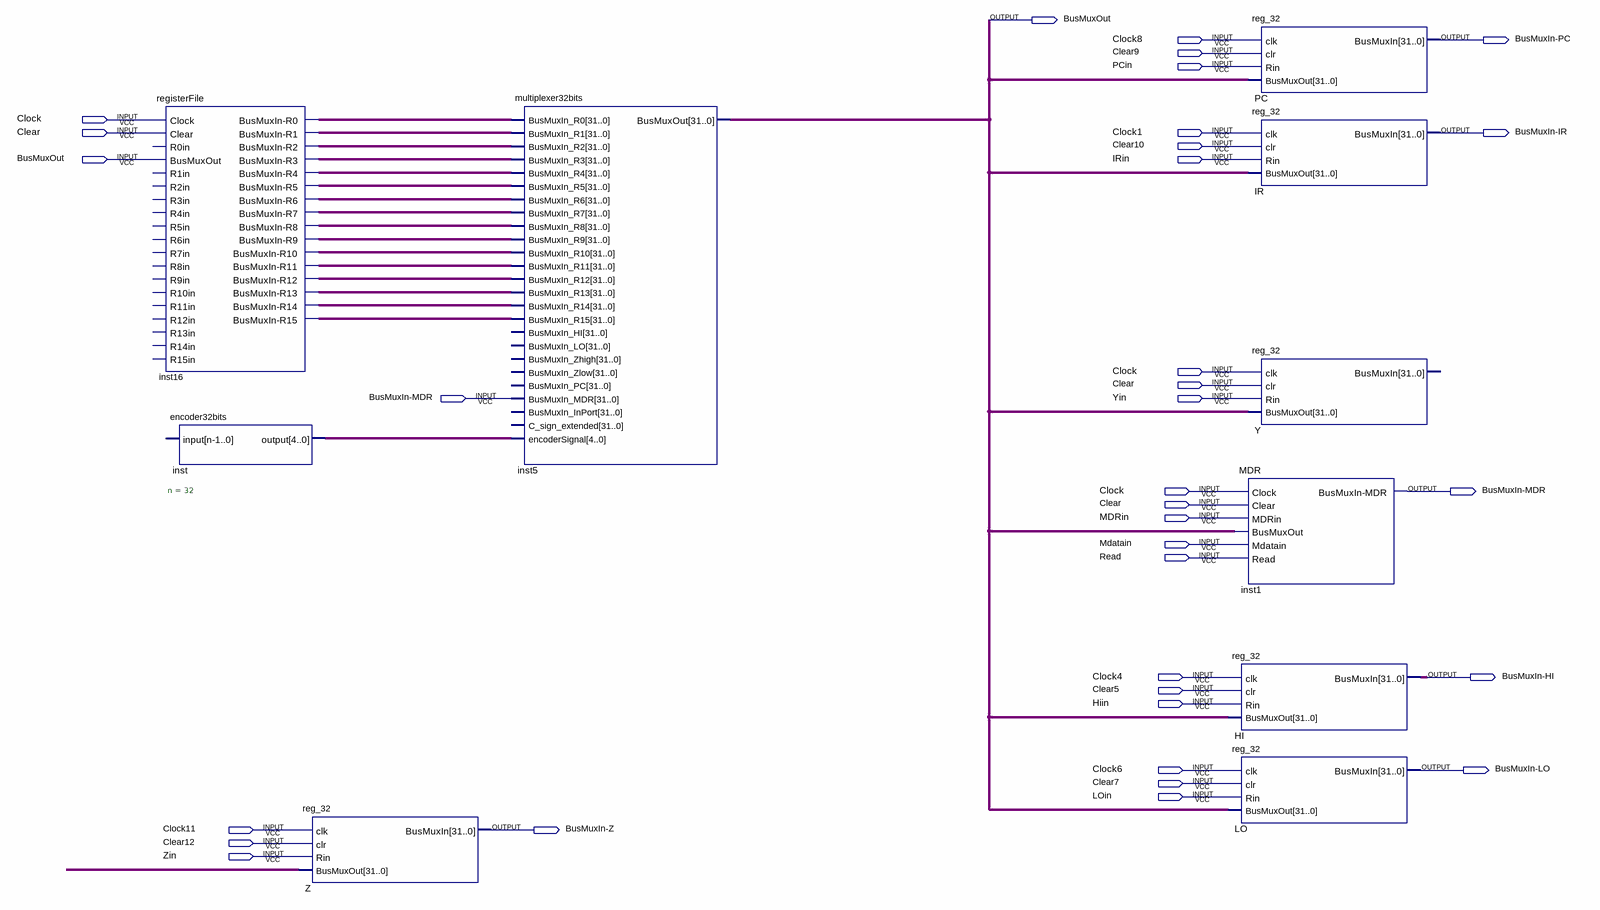
[diagram p0: schematic sheet]
// Quartus schematic phase1_BlockDiagram.bdf as structural Verilog: 10 symbols, 34 pins
module phase1_BlockDiagram (
  input  Clock8,
  input  Clear9,
  input  PCin,
  input  Clock,
  input  Clear,
  input  Clock1,
  input  Clear10,
  inout  BusMuxOut,
  input  IRin,
  inout  \BusMuxIn-MDR ,
  input  Yin,
  input  MDRin,
  input  Mdatain,
  input  Read,
  input  Clock4,
  input  Clear5,
  input  Hiin,
  input  Clock6,
  input  Clear7,
  input  LOin,
  input  Clock11,
  input  Clear12,
  input  Zin,
  output \BusMuxIn-PC ,
  output \BusMuxIn-IR ,
  output \BusMuxIn-HI ,
  output \BusMuxIn-LO ,
  output \BusMuxIn-Z 
);

  wire [4:0] inst_output;
  wire [31:0] HI_busmuxin, inst5_busmuxout, inst16_busmuxin_r0, inst16_busmuxin_r1, inst16_busmuxin_r2,
       inst16_busmuxin_r3, inst16_busmuxin_r4, inst16_busmuxin_r5, inst16_busmuxin_r6, inst16_busmuxin_r7,
       inst16_busmuxin_r8, inst16_busmuxin_r9, inst16_busmuxin_r10, inst16_busmuxin_r11, inst16_busmuxin_r12,
       inst16_busmuxin_r13, inst16_busmuxin_r14, inst16_busmuxin_r15, undriven;

  registerFile inst16 (
    .Clock(Clock), .Clear(Clear), .BusMuxOut(BusMuxOut), .\BusMuxIn-R0 (inst16_busmuxin_r0),
    .\BusMuxIn-R1 (inst16_busmuxin_r1), .\BusMuxIn-R2 (inst16_busmuxin_r2),
    .\BusMuxIn-R3 (inst16_busmuxin_r3), .\BusMuxIn-R4 (inst16_busmuxin_r4),
    .\BusMuxIn-R5 (inst16_busmuxin_r5), .\BusMuxIn-R6 (inst16_busmuxin_r6),
    .\BusMuxIn-R7 (inst16_busmuxin_r7), .\BusMuxIn-R8 (inst16_busmuxin_r8),
    .\BusMuxIn-R9 (inst16_busmuxin_r9), .\BusMuxIn-R10 (inst16_busmuxin_r10),
    .\BusMuxIn-R11 (inst16_busmuxin_r11), .\BusMuxIn-R12 (inst16_busmuxin_r12),
    .\BusMuxIn-R13 (inst16_busmuxin_r13), .\BusMuxIn-R14 (inst16_busmuxin_r14),
    .\BusMuxIn-R15 (inst16_busmuxin_r15));  // open: R0in, R1in, R2in, R3in, R4in, R5in, R6in, R7in, R8in, R9in, R10in, R11in, R12in, R13in, R14in, R15in
  encoder32bits #(.n(32)) inst (.\output (inst_output));  // open: input
  reg_32 Z (.clk(Clock11), .clr(Clear12), .Rin(Zin), .BusMuxOut(undriven), .BusMuxIn(\BusMuxIn-Z ));
  multiplexer32bits inst5 (
    .BusMuxIn_R0(inst16_busmuxin_r0), .BusMuxIn_R1(inst16_busmuxin_r1), .BusMuxIn_R2(inst16_busmuxin_r2),
    .BusMuxIn_R3(inst16_busmuxin_r3), .BusMuxIn_R4(inst16_busmuxin_r4), .BusMuxIn_R5(inst16_busmuxin_r5),
    .BusMuxIn_R6(inst16_busmuxin_r6), .BusMuxIn_R7(inst16_busmuxin_r7), .BusMuxIn_R8(inst16_busmuxin_r8),
    .BusMuxIn_R9(inst16_busmuxin_r9), .BusMuxIn_R10(inst16_busmuxin_r10), .BusMuxIn_R11(inst16_busmuxin_r11),
    .BusMuxIn_R12(inst16_busmuxin_r12), .BusMuxIn_R13(inst16_busmuxin_r13),
    .BusMuxIn_R14(inst16_busmuxin_r14), .BusMuxIn_R15(inst16_busmuxin_r15),
    .BusMuxIn_MDR({32{\BusMuxIn-MDR }}), .encoderSignal(inst_output), .BusMuxOut(inst5_busmuxout));  // open: BusMuxIn_HI, BusMuxIn_LO, BusMuxIn_Zhigh, BusMuxIn_Zlow, BusMuxIn_PC, BusMuxIn_InPort, C_sign_extended
  MDR inst1 (
    .Clock(Clock), .Clear(Clear), .MDRin(MDRin), .BusMuxOut(inst5_busmuxout), .Mdatain(Mdatain), .Read(Read),
    .\BusMuxIn-MDR (\BusMuxIn-MDR ));
  reg_32 HI (.clk(Clock4), .clr(Clear5), .Rin(Hiin), .BusMuxOut(inst5_busmuxout), .BusMuxIn(HI_busmuxin));
  reg_32 LO (.clk(Clock6), .clr(Clear7), .Rin(LOin), .BusMuxOut(inst5_busmuxout), .BusMuxIn(\BusMuxIn-LO ));
  reg_32 PC (.clk(Clock8), .clr(Clear9), .Rin(PCin), .BusMuxOut(inst5_busmuxout), .BusMuxIn(\BusMuxIn-PC ));
  reg_32 IR (.clk(Clock1), .clr(Clear10), .Rin(IRin), .BusMuxOut(inst5_busmuxout), .BusMuxIn(\BusMuxIn-IR ));
  reg_32 Y (.clk(Clock), .clr(Clear), .Rin(Yin), .BusMuxOut(inst5_busmuxout));  // open: BusMuxIn
endmodule
